# Altium schematic sheet EvalBoardTester.SchDoc: LiveDesign Evaluation - EvalBoard Tester
size C; Organization: Altium Limited; Address1: L3, 12a Rodborough Rd; Address2: Frenchs Forest; Address3: NSW; Address4: Australia 2086; DocumentNumber: 1; SheetNumber: 1; SheetTotal: 16
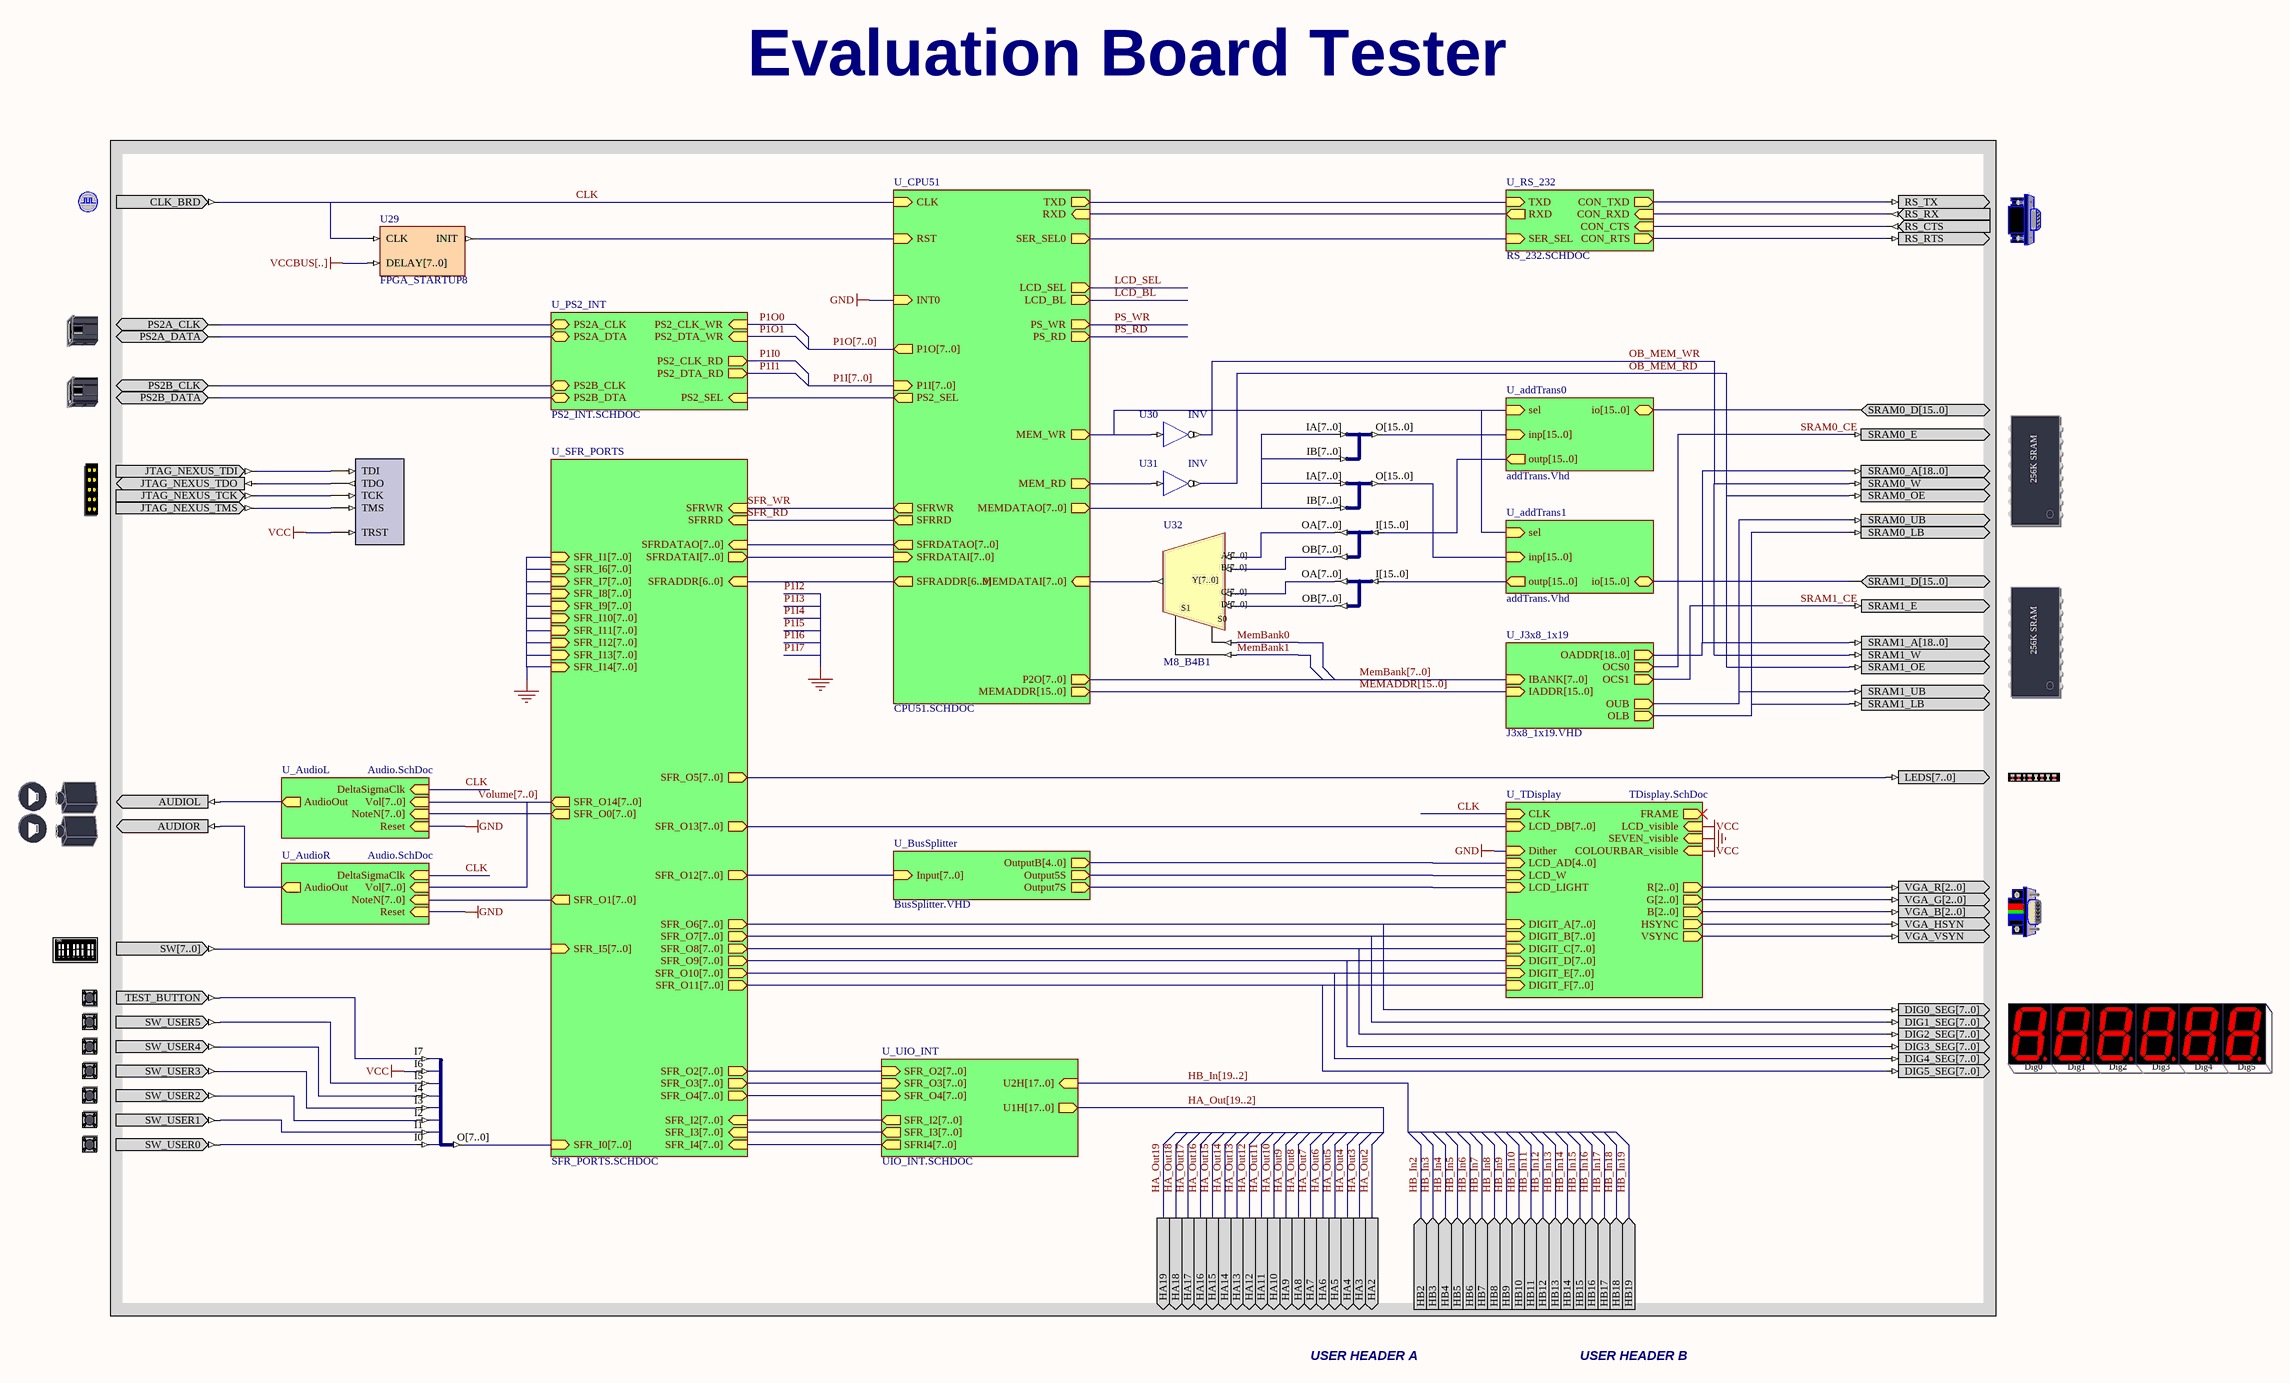
[diagram p0: EvalBoardTester.SchDoc]

## Parts
(Parts that share a designator on the sheet are numbered #1, #2 ... from top to bottom, then left to right.)
NEXUS_JTAG_PORT  NEXUS_JTAG_PORT  (value not drawn)
U24  J16B_8B2  (value not drawn)
U25  J16B_8B2  (value not drawn)
U26  J8B2_16B  (value not drawn)
U27  J8B2_16B  (value not drawn)
U28  J8S_8B  (value not drawn)
U29  FPGA_STARTUP8
U30  INV
U31  INV
U32  M8_B4B1
U?#1  CLOCK_BOARD  (value not drawn)
U?#2  RS232CNTR  (value not drawn)
U?#3  PS2A  (value not drawn)
U?#4  PS2B  (value not drawn)
U?#5  SRAM_0  (value not drawn)
U?#6  NEXUS_JTAG_CONNECTOR  (value not drawn)
U?#7  SRAM_1  (value not drawn)
U?#8  LED  (value not drawn)
U?#9  STEREO  (value not drawn)
U?#10  VGACNTR  (value not drawn)
U?#11  DIPSWITCH  (value not drawn)
U?#12  TEST_BUTTON  (value not drawn)
U?#13  7SEGX6  (value not drawn)
U?#14  USER_BUTTONX6  (value not drawn)

## Sub-sheets
U_addTrans0 = addTrans.Vhd: inp[15..0] (in), io[15..0] (bidir), outp[15..0] (out), sel (in)  | VHDLENTITY: addTrans
U_addTrans1 = addTrans.Vhd: inp[15..0] (in), io[15..0] (bidir), outp[15..0] (out), sel (in)  | VHDLENTITY: addTrans
U_AudioL = Audio.SchDoc: AudioOut (out), DeltaSigmaClk (in), Reset (in), NoteN[7..0] (in), Vol[7..0] (in)
U_AudioR = Audio.SchDoc: AudioOut (out), DeltaSigmaClk (in), Reset (in), NoteN[7..0] (in), Vol[7..0] (in)
U_BusSplitter = BusSplitter.VHD: Input[7..0] (in), OutputB[4..0] (out), Output5S (out), Output7S (out)
U_CPU51 = CPU51.SCHDOC: CLK (in), RXD (in), TXD (out), MEMADDR[15..0] (out), MEM_WR (out), MEM_RD (out), SFRDATAO[7..0] (out), SFRDATAI[7..0] (in), SFRWR (out), SFRRD (out), SFRADDR[6..0] (out), LCD_BL (out), INT0 (in), P1O[7..0] (out), P1I[7..0] (in), MEMDATAO[7..0] (out), MEMDATAI[7..0] (in), PS_WR (out), PS_RD (out), PS2_SEL (out), SER_SEL0 (out), P2O[7..0] (out), LCD_SEL (out), RST (in)
U_J3x8_1x19 = J3x8_1x19.VHD: IADDR[15..0] (in), IBANK[7..0] (in), OADDR[18..0] (out), OCS0 (out), OCS1 (out), OLB (out), OUB (out)  | VHDLENTITY: J3x8_1x19
U_PS2_INT = PS2_INT.SCHDOC: PS2B_CLK (bidir), PS2B_DTA (bidir), PS2_CLK_WR (in), PS2_DTA_WR (in), PS2A_CLK (bidir), PS2A_DTA (bidir), PS2_CLK_RD (out), PS2_DTA_RD (out), PS2_SEL (in)
U_RS_232 = RS_232.SCHDOC: TXD (in), RXD (out), CON_TXD (out), CON_CTS (in), CON_RXD (in), CON_RTS (out), SER_SEL (in)
U_SFR_PORTS = SFR_PORTS.SCHDOC: SFRDATAO[7..0] (in), SFRWR (in), SFRDATAI[7..0] (out), SFRRD (in), SFRADDR[6..0] (in), SFR_I0[7..0] (in), SFR_I1[7..0] (in), SFR_O1[7..0] (out), SFR_I2[7..0] (in), SFR_O2[7..0] (out), SFR_I3[7..0] (in), SFR_O3[7..0] (out), SFR_I4[7..0] (in), SFR_O4[7..0] (out), SFR_O5[7..0] (out), SFR_O6[7..0] (out), SFR_O7[7..0] (out), SFR_O8[7..0] (out), SFR_O9[7..0] (out), SFR_O10[7..0] (out), SFR_I7[7..0] (in), SFR_I5[7..0] (in), SFR_O11[7..0] (out), SFR_I9[7..0] (in), SFR_O0[7..0] (out), SFR_I11[7..0] (in), SFR_I10[7..0] (in), SFR_I6[7..0] (in), SFR_I8[7..0] (in), SFR_I12[7..0] (in), SFR_O12[7..0] (out), SFR_I13[7..0] (in), SFR_O13[7..0] (out), SFR_O14[7..0] (out), SFR_I14[7..0] (in)
U_TDisplay = TDisplay.SchDoc: CLK (in), HSYNC (out), VSYNC (out), FRAME (out), DIGIT_A[7..0] (in), DIGIT_B[7..0] (in), DIGIT_C[7..0] (in), DIGIT_D[7..0] (in), DIGIT_E[7..0] (in), DIGIT_F[7..0] (in), R[2..0] (out), G[2..0] (out), B[2..0] (out), LCD_LIGHT (in), LCD_W (in), LCD_DB[7..0] (in), LCD_AD[4..0] (in), SEVEN_visible (in), LCD_visible (in), Dither (in), COLOURBAR_visible (in)
U_UIO_INT = UIO_INT.SCHDOC: U2H[17..0] (in), SFR_I2[7..0] (out), SFR_I3[7..0] (out), SFRI4[7..0] (out), U1H[17..0] (out), SFR_O2[7..0] (in), SFR_O3[7..0] (in), SFR_O4[7..0] (in)

## Ports
HA2 (out), HA3 (out), HA4 (out), HA5 (out), HA6 (out), HA7 (out), HA8 (out), HA9 (out), HA10 (out), HA11 (out), HA12 (out), HA13 (out), HA14 (out), HA15 (out), HA16 (out), HA17 (out), HA18 (out), HA19 (out), HB2 (in), HB3 (in), HB4 (in), HB5 (in), HB6 (in), HB7 (in), HB8 (in), HB9 (in), HB10 (in), HB11 (in), HB12 (in), HB13 (in), HB14 (in), HB15 (in), HB16 (in), HB17 (in), HB18 (in), HB19 (in)

## Nets
P1I2: sheet U_CPU51/INT0, sheet U_AudioL/Reset, sheet U_AudioR/Reset, sheet U_TDisplay/SEVEN_visible, sheet U_TDisplay/Dither  [also labelled GND, P1I3, P1I4, P1I5, P1I6, P1I7]
VCC: NEXUS_JTAG_PORT.TRST U28.I6 ; sheet U_TDisplay/LCD_visible, sheet U_TDisplay/COLOURBAR_visible
VCCBUS[..]: U29.DELAY[7..0]
CLK: U29.CLK U?#1.CLK_BRD ; sheet U_CPU51/CLK, sheet U_AudioL/DeltaSigmaClk, sheet U_AudioR/DeltaSigmaClk, sheet U_TDisplay/CLK
HA_Out2: port HA2
HA_Out3: port HA3
HA_Out4: port HA4
HA_Out5: port HA5
HA_Out6: port HA6
HA_Out7: port HA7
HA_Out8: port HA8
HA_Out9: port HA9
HA_Out10: port HA10
HA_Out11: port HA11
HA_Out12: port HA12
HA_Out13: port HA13
HA_Out14: port HA14
HA_Out15: port HA15
HA_Out16: port HA16
HA_Out17: port HA17
HA_Out18: port HA18
HA_Out19: port HA19
HB_In2: port HB2
HB_In3: port HB3
HB_In4: port HB4
HB_In5: port HB5
HB_In6: port HB6
HB_In7: port HB7
HB_In8: port HB8
HB_In9: port HB9
HB_In10: port HB10
HB_In11: port HB11
HB_In12: port HB12
HB_In13: port HB13
HB_In14: port HB14
HB_In15: port HB15
HB_In16: port HB16
HB_In17: port HB17
HB_In18: port HB18
HB_In19: port HB19
LCD_BL: sheet U_CPU51/LCD_BL
LCD_SEL: sheet U_CPU51/LCD_SEL
MemBank0: U32.S0
MemBank1: U32.S1
OB_MEM_RD: U31.O U?#5.SRAM0_OE U?#7.SRAM1_OE
OB_MEM_WR: U30.O U?#5.SRAM0_W U?#7.SRAM1_W
P1I0: sheet U_PS2_INT/PS2_CLK_RD
P1I1: sheet U_PS2_INT/PS2_DTA_RD
P1O0: sheet U_PS2_INT/PS2_CLK_WR
P1O1: sheet U_PS2_INT/PS2_DTA_WR
PS_RD: sheet U_CPU51/PS_RD
PS_WR: sheet U_CPU51/PS_WR
SFR_RD: sheet U_SFR_PORTS/SFRRD, sheet U_CPU51/SFRRD
SFR_WR: sheet U_SFR_PORTS/SFRWR, sheet U_CPU51/SFRWR
SRAM0_CE: U?#5.SRAM0_E ; sheet U_J3x8_1x19/OCS0
SRAM1_CE: U?#7.SRAM1_E ; sheet U_J3x8_1x19/OCS1
NetNEXUS_JTAG_PORT_TCK: NEXUS_JTAG_PORT.TCK U?#6.JTAG_NEXUS_TCK
NetNEXUS_JTAG_PORT_TDI: NEXUS_JTAG_PORT.TDI U?#6.JTAG_NEXUS_TDI
NetNEXUS_JTAG_PORT_TDO: NEXUS_JTAG_PORT.TDO U?#6.JTAG_NEXUS_TDO
NetNEXUS_JTAG_PORT_TMS: NEXUS_JTAG_PORT.TMS U?#6.JTAG_NEXUS_TMS
NetU24_I[15..0]: U24.I[15..0] ; sheet U_addTrans0/outp[15..0]
NetU24_OA[7..0]: U24.OA[7..0] U32.A[7..0]
NetU24_OB[7..0]: U24.OB[7..0] U32.B[7..0]
NetU25_I[15..0]: U25.I[15..0] ; sheet U_addTrans1/outp[15..0]
NetU25_OA[7..0]: U25.OA[7..0] U32.C[7..0]
NetU25_OB[7..0]: U25.OB[7..0] U32.D[7..0]
NetU26_IA[7..0]: U26.IA[7..0] U26.IB[7..0] U27.IA[7..0] U27.IB[7..0] ; sheet U_CPU51/MEMDATAO[7..0]
NetU26_O[15..0]: U26.O[15..0] ; sheet U_addTrans0/inp[15..0]
NetU27_O[15..0]: U27.O[15..0] ; sheet U_addTrans1/inp[15..0]
NetU28_I0: U28.I0 U?#14.SW_USER0
NetU28_I1: U28.I1 U?#14.SW_USER1
NetU28_I2: U28.I2 U?#14.SW_USER2
NetU28_I3: U28.I3 U?#14.SW_USER3
NetU28_I4: U28.I4 U?#14.SW_USER4
NetU28_I5: U28.I5 U?#14.SW_USER5
NetU28_I7: U28.I7 U?#12.TEST_BUTTON
NetU28_O[7..0]: U28.O[7..0] ; sheet U_SFR_PORTS/SFR_I0[7..0]
NetU29_INIT: U29.INIT ; sheet U_CPU51/RST
NetU30_I: U30.I ; sheet U_CPU51/MEM_WR, sheet U_addTrans1/sel, sheet U_addTrans0/sel
NetU31_I: U31.I ; sheet U_CPU51/MEM_RD
NetU32_Y[7..0]: U32.Y[7..0] ; sheet U_CPU51/MEMDATAI[7..0]
NetU?#2_RS_CTS: U?#2.RS_CTS ; sheet U_RS_232/CON_CTS
NetU?#2_RS_RTS: U?#2.RS_RTS ; sheet U_RS_232/CON_RTS
NetU?#2_RS_RX: U?#2.RS_RX ; sheet U_RS_232/CON_RXD
NetU?#2_RS_TX: U?#2.RS_TX ; sheet U_RS_232/CON_TXD
NetU?#3_PS2A_CLK: U?#3.PS2A_CLK ; sheet U_PS2_INT/PS2A_CLK
NetU?#3_PS2A_DATA: U?#3.PS2A_DATA ; sheet U_PS2_INT/PS2A_DTA
NetU?#4_PS2B_CLK: U?#4.PS2B_CLK ; sheet U_PS2_INT/PS2B_CLK
NetU?#4_PS2B_DATA: U?#4.PS2B_DATA ; sheet U_PS2_INT/PS2B_DTA
NetU?#5_SRAM0_A[18..0]: U?#5.SRAM0_A[18..0] U?#7.SRAM1_A[18..0] ; sheet U_J3x8_1x19/OADDR[18..0]
NetU?#5_SRAM0_D[15..0]: U?#5.SRAM0_D[15..0] ; sheet U_addTrans0/io[15..0]
NetU?#5_SRAM0_LB: U?#5.SRAM0_LB U?#7.SRAM1_LB ; sheet U_J3x8_1x19/OLB
NetU?#5_SRAM0_UB: U?#5.SRAM0_UB U?#7.SRAM1_UB ; sheet U_J3x8_1x19/OUB
NetU?#7_SRAM1_D[15..0]: U?#7.SRAM1_D[15..0] ; sheet U_addTrans1/io[15..0]
NetU?#8_LEDS[7..0]: U?#8.LEDS[7..0] ; sheet U_SFR_PORTS/SFR_O5[7..0]
NetU?#9_AUDIOL: U?#9.AUDIOL ; sheet U_AudioL/AudioOut
NetU?#9_AUDIOR: U?#9.AUDIOR ; sheet U_AudioR/AudioOut
NetU?#10_VGA_B[2..0]: U?#10.VGA_B[2..0] ; sheet U_TDisplay/B[2..0]
NetU?#10_VGA_G[2..0]: U?#10.VGA_G[2..0] ; sheet U_TDisplay/G[2..0]
NetU?#10_VGA_HSYN: U?#10.VGA_HSYN ; sheet U_TDisplay/HSYNC
NetU?#10_VGA_R[2..0]: U?#10.VGA_R[2..0] ; sheet U_TDisplay/R[2..0]
NetU?#10_VGA_VSYN: U?#10.VGA_VSYN ; sheet U_TDisplay/VSYNC
NetU?#11_SW[7..0]: U?#11.SW[7..0] ; sheet U_SFR_PORTS/SFR_I5[7..0]
NetU?#13_DIG0_SEG[7..0]: U?#13.DIG0_SEG[7..0] ; sheet U_SFR_PORTS/SFR_O6[7..0], sheet U_TDisplay/DIGIT_A[7..0]
NetU?#13_DIG1_SEG[7..0]: U?#13.DIG1_SEG[7..0] ; sheet U_SFR_PORTS/SFR_O7[7..0], sheet U_TDisplay/DIGIT_B[7..0]
NetU?#13_DIG2_SEG[7..0]: U?#13.DIG2_SEG[7..0] ; sheet U_SFR_PORTS/SFR_O8[7..0], sheet U_TDisplay/DIGIT_C[7..0]
NetU?#13_DIG3_SEG[7..0]: U?#13.DIG3_SEG[7..0] ; sheet U_SFR_PORTS/SFR_O9[7..0], sheet U_TDisplay/DIGIT_D[7..0]
NetU?#13_DIG4_SEG[7..0]: U?#13.DIG4_SEG[7..0] ; sheet U_SFR_PORTS/SFR_O10[7..0], sheet U_TDisplay/DIGIT_E[7..0]
NetU?#13_DIG5_SEG[7..0]: U?#13.DIG5_SEG[7..0] ; sheet U_SFR_PORTS/SFR_O11[7..0], sheet U_TDisplay/DIGIT_F[7..0]
(unnamed): sheet U_CPU51/RXD, sheet U_RS_232/RXD
(unnamed): sheet U_CPU51/TXD, sheet U_RS_232/TXD
(unnamed): sheet U_CPU51/PS2_SEL, sheet U_PS2_INT/PS2_SEL
(unnamed): sheet U_CPU51/SER_SEL0, sheet U_RS_232/SER_SEL
(unnamed): sheet U_BusSplitter/Output5S, sheet U_TDisplay/LCD_W
(unnamed): sheet U_BusSplitter/Output7S, sheet U_TDisplay/LCD_LIGHT

## Buses and harness runs
bus HA_Out[19..2] = sheet U_UIO_INT/U1H[17..0]
bus HB_In[19..2] = sheet U_UIO_INT/U2H[17..0]
bus MEMADDR[15..0] = sheet U_CPU51/MEMADDR[15..0] = sheet U_J3x8_1x19/IADDR[15..0]
bus MemBank[7..0] = sheet U_CPU51/P2O[7..0] = sheet U_J3x8_1x19/IBANK[7..0]
bus P1I[7..0] = sheet U_CPU51/P1I[7..0]
bus P1O[7..0] = sheet U_CPU51/P1O[7..0]
bus sheet U_AudioL/NoteN[7..0] = sheet U_SFR_PORTS/SFR_O0[7..0]
bus sheet U_AudioR/NoteN[7..0] = sheet U_SFR_PORTS/SFR_O1[7..0]
bus sheet U_BusSplitter/Input[7..0] = sheet U_SFR_PORTS/SFR_O12[7..0]
bus sheet U_BusSplitter/OutputB[4..0] = sheet U_TDisplay/LCD_AD[4..0]
bus sheet U_CPU51/SFRADDR[6..0] = sheet U_SFR_PORTS/SFRADDR[6..0]
bus sheet U_CPU51/SFRDATAI[7..0] = sheet U_SFR_PORTS/SFRDATAI[7..0]
bus sheet U_CPU51/SFRDATAO[7..0] = sheet U_SFR_PORTS/SFRDATAO[7..0]
bus sheet U_SFR_PORTS/SFR_I1[7..0] = sheet U_SFR_PORTS/SFR_I6[7..0] = sheet U_SFR_PORTS/SFR_I7[7..0] = sheet U_SFR_PORTS/SFR_I8[7..0] = sheet U_SFR_PORTS/SFR_I9[7..0] = sheet U_SFR_PORTS/SFR_I10[7..0] = sheet U_SFR_PORTS/SFR_I11[7..0] = sheet U_SFR_PORTS/SFR_I12[7..0] = sheet U_SFR_PORTS/SFR_I13[7..0] = sheet U_SFR_PORTS/SFR_I14[7..0]
bus sheet U_SFR_PORTS/SFR_I2[7..0] = sheet U_UIO_INT/SFR_I2[7..0]
bus sheet U_SFR_PORTS/SFR_I3[7..0] = sheet U_UIO_INT/SFR_I3[7..0]
bus sheet U_SFR_PORTS/SFR_I4[7..0] = sheet U_UIO_INT/SFRI4[7..0]
bus sheet U_SFR_PORTS/SFR_O2[7..0] = sheet U_UIO_INT/SFR_O2[7..0]
bus sheet U_SFR_PORTS/SFR_O3[7..0] = sheet U_UIO_INT/SFR_O3[7..0]
bus sheet U_SFR_PORTS/SFR_O4[7..0] = sheet U_UIO_INT/SFR_O4[7..0]
bus sheet U_SFR_PORTS/SFR_O6[7..0] = sheet U_TDisplay/DIGIT_A[7..0]
bus sheet U_SFR_PORTS/SFR_O7[7..0] = sheet U_TDisplay/DIGIT_B[7..0]
bus sheet U_SFR_PORTS/SFR_O8[7..0] = sheet U_TDisplay/DIGIT_C[7..0]
bus sheet U_SFR_PORTS/SFR_O9[7..0] = sheet U_TDisplay/DIGIT_D[7..0]
bus sheet U_SFR_PORTS/SFR_O10[7..0] = sheet U_TDisplay/DIGIT_E[7..0]
bus sheet U_SFR_PORTS/SFR_O11[7..0] = sheet U_TDisplay/DIGIT_F[7..0]
bus sheet U_SFR_PORTS/SFR_O13[7..0] = sheet U_TDisplay/LCD_DB[7..0]
bus Volume[7..0] = sheet U_AudioL/Vol[7..0] = sheet U_AudioR/Vol[7..0] = sheet U_SFR_PORTS/SFR_O14[7..0]

## Notes on the sheet
- Evaluation Board Tester
- USER HEADER A
- USER HEADER B
- Title
- Size:
- Date:
- File:
- C
- Number:
- Time:
- Revision:
- Sheet
- of
- (in symbol 7SEGX6) Dig0; Dig1; Dig2; Dig3; Dig4; Dig5
- (in symbol DIPSWITCH) ON; 1; 2; 3; 4; 5; 6; 7; 8
- (in symbol SRAM_0) 256K SRAM
- (in symbol SRAM_1) 256K SRAM

## Library data of the parts
NEXUS_JTAG_PORT = NEXUS_JTAG_PORT: Nexus Processor JTAG Chain Connector; NEXUS_JTAG_CONNECTOR: True; Published: 5-Sep-2003; Publisher: Altium Hobart Technology Centre
U24 U25 = J16B_8B2: 1 x 16-bit input bus to 2 x 8-Bit output bus; ArchiveName: GENERIC; VHDLIB_SIM: GENERIC_LIB; Published: 29-Jan-2004; Publisher: Altium Limited; Core Revision: 1.00.00
U26 U27 = J8B2_16B: 2 x 8-Bit input bus to 1 x 16-bit output bus; ArchiveName: GENERIC; VHDLIB_SIM: GENERIC_LIB; Published: 29-Jan-2004; Publisher: Altium Limited; Core Revision: 1.00.00
U28 = J8S_8B: 8 Single pin inputs to single 8-Bit output bus; Functional Class: Bus Joiner; Port Size: 8; ArchiveName: GENERIC; VHDLIB_SIM: GENERIC_LIB; Published: 29-Jan-2004; Publisher: Altium Limited; Core Revision: 1.00.00; HelpURL: CR0118 FPGA Generic Library Guide.pdf#page=305
U29 = FPGA_STARTUP8: FPGA Startup With 8 Bit Delay; Published: 21/01/2004; Publisher: Altium Hobart Technology Centre; Core Revision: 1.00.00
U30 U31 = INV: Inverter; Functional Class: Logic Primitive; ArchiveName: GENERIC; VHDLIB_SIM: GENERIC_LIB; Published: 29-Jan-2004; Publisher: Altium Limited; Xilinx Equivalent: INV; Core Revision: 1.00.00; HelpURL: CR0118 FPGA Generic Library Guide.pdf#page=290; Sub Class: INV
U32 = M8_B4B1: 4x8-Bit Bus to 1x8-Bit Bus Multiplexer; ArchiveName: GENERIC; VHDLIB_SIM: GENERIC_LIB; Published: 29-Jan-2004; Publisher: Altium Limited; Core Revision: 1.00.00
U?#1 = CLOCK_BOARD: Global System Clock Supply; PortComponent: True; Published: 19-Nov-2003; Publisher: Altium Limited
U?#2 = RS232CNTR: DCE Serial Port Connector; PortComponent: True; Published: 19-Nov-2003; Publisher: Altium Limited
U?#3 = PS2A: Mouse PS2 Connector; PortComponent: True; Published: 19-Nov-2003; Publisher: Altium Limited
U?#4 = PS2B: Key Board PS2 Connector; PortComponent: True; Published: 19-Nov-2003; Publisher: Altium Limited
U?#5 = SRAM_0: SRAM - 0 Module - 256K; PortComponent: True; Published: 13-May-2004; Publisher: Altium Limited
U?#6 = NEXUS_JTAG_CONNECTOR: JTAG Port; PortComponent: True; Published: 19-Nov-2003; Publisher: Altium Limited
U?#7 = SRAM_1: SRAM - 1 Module - 256K; PortComponent: True; Published: 13-May-2004; Publisher: Altium Limited
U?#8 = LED: 8-Way LEDS; PortComponent: True; Published: 19-Nov-2003; Publisher: Altium Limited
U?#9 = STEREO: Sound interface; PortComponent: True; Published: 19-Nov-2003; Publisher: Altium Limited
U?#10 = VGACNTR: VGA Dsub-15-Female-HD; PortComponent: True; Published: 19-Nov-2003; Publisher: Altium Limited
U?#11 = DIPSWITCH: 8-Way Dip Switch; PortComponent: True; Published: 19-Nov-2003; Publisher: Altium Limited
U?#12 = TEST_BUTTON: Test Button; PortComponent: True; Published: 19-Nov-2003; Publisher: Altium Limited
U?#13 = 7SEGX6: 6 x 7 Segment display module; PortComponent: True; Publisher: Altium Limited; Published: 9-Sept-2004
U?#14 = USER_BUTTONX6: User Buttons; PortComponent: True; Published: 19-Nov-2003; Publisher: Altium Limited